# Altium schematic sheet In-Out.SchDoc
size A4
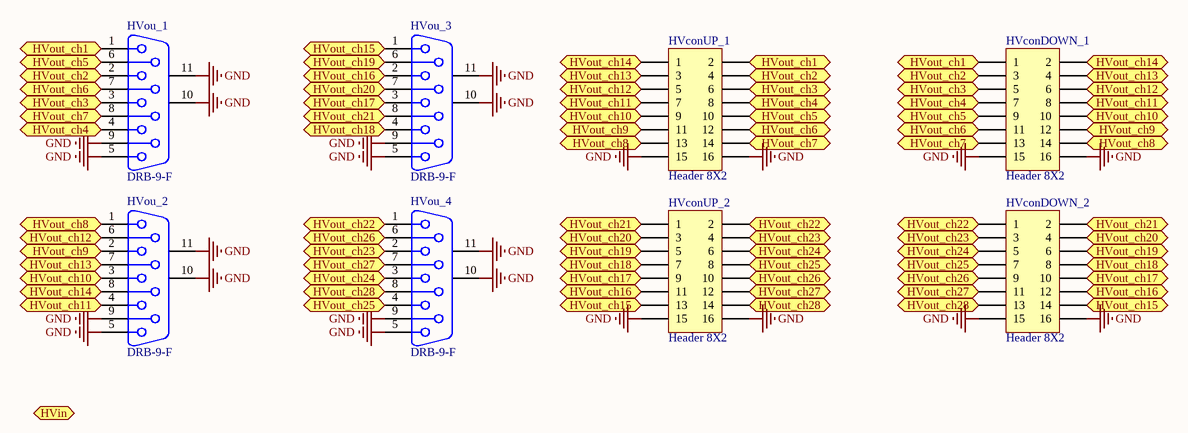
[diagram p0: In-Out.SchDoc]

## Parts
HVconDOWN_1  Header 8X2  [HDR2X8]
HVconDOWN_2  Header 8X2  [HDR2X8]
HVconUP_1  Header 8X2  [HDR2X8]
HVconUP_2  Header 8X2  [HDR2X8]
HVou_1  DRB-9-F  [DSUB1.385-2H9]
HVou_2  DRB-9-F  [DSUB1.385-2H9]
HVou_3  DRB-9-F  [DSUB1.385-2H9]
HVou_4  DRB-9-F  [DSUB1.385-2H9]

## Ports
HVin (out), HVout_ch1 (out), HVout_ch2 (out), HVout_ch3 (out), HVout_ch4 (out), HVout_ch5 (out), HVout_ch6 (out), HVout_ch7 (out), HVout_ch8 (out), HVout_ch9 (out), HVout_ch10 (out), HVout_ch11 (out), HVout_ch12 (out), HVout_ch13 (out), HVout_ch14 (out), HVout_ch15 (out), HVout_ch16 (out), HVout_ch17 (out), HVout_ch18 (out), HVout_ch19 (out), HVout_ch20 (out), HVout_ch21 (out), HVout_ch22 (out), HVout_ch23 (out), HVout_ch24 (out), HVout_ch25 (out), HVout_ch26 (out), HVout_ch27 (out), HVout_ch28 (out)

## Nets
GND: HVconDOWN_1.15 HVconDOWN_1.16 HVconDOWN_2.15 HVconDOWN_2.16 HVconUP_1.15 HVconUP_1.16 HVconUP_2.15 HVconUP_2.16 HVou_1.5 HVou_1.9 HVou_1.10(MH1) HVou_1.11(MH2) HVou_2.5 HVou_2.9 HVou_2.10(MH1) HVou_2.11(MH2) HVou_3.5 HVou_3.9 HVou_3.10(MH1) HVou_3.11(MH2) HVou_4.5 HVou_4.9 HVou_4.10(MH1) HVou_4.11(MH2)
HVout_ch1: HVconDOWN_1.1 HVconUP_1.2 HVou_1.1 ; port HVout_ch1
HVout_ch2: HVconDOWN_1.3 HVconUP_1.4 HVou_1.2 ; port HVout_ch2
HVout_ch3: HVconDOWN_1.5 HVconUP_1.6 HVou_1.3 ; port HVout_ch3
HVout_ch4: HVconDOWN_1.7 HVconUP_1.8 HVou_1.4 ; port HVout_ch4
HVout_ch5: HVconDOWN_1.9 HVconUP_1.10 HVou_1.6 ; port HVout_ch5
HVout_ch6: HVconDOWN_1.11 HVconUP_1.12 HVou_1.7 ; port HVout_ch6
HVout_ch7: HVconDOWN_1.13 HVconUP_1.14 HVou_1.8 ; port HVout_ch7
HVout_ch8: HVconDOWN_1.14 HVconUP_1.13 HVou_2.1 ; port HVout_ch8
HVout_ch9: HVconDOWN_1.12 HVconUP_1.11 HVou_2.2 ; port HVout_ch9
HVout_ch10: HVconDOWN_1.10 HVconUP_1.9 HVou_2.3 ; port HVout_ch10
HVout_ch11: HVconDOWN_1.8 HVconUP_1.7 HVou_2.4 ; port HVout_ch11
HVout_ch12: HVconDOWN_1.6 HVconUP_1.5 HVou_2.6 ; port HVout_ch12
HVout_ch13: HVconDOWN_1.4 HVconUP_1.3 HVou_2.7 ; port HVout_ch13
HVout_ch14: HVconDOWN_1.2 HVconUP_1.1 HVou_2.8 ; port HVout_ch14
HVout_ch15: HVconDOWN_2.14 HVconUP_2.13 HVou_3.1 ; port HVout_ch15
HVout_ch16: HVconDOWN_2.12 HVconUP_2.11 HVou_3.2 ; port HVout_ch16
HVout_ch17: HVconDOWN_2.10 HVconUP_2.9 HVou_3.3 ; port HVout_ch17
HVout_ch18: HVconDOWN_2.8 HVconUP_2.7 HVou_3.4 ; port HVout_ch18
HVout_ch19: HVconDOWN_2.6 HVconUP_2.5 HVou_3.6 ; port HVout_ch19
HVout_ch20: HVconDOWN_2.4 HVconUP_2.3 HVou_3.7 ; port HVout_ch20
HVout_ch21: HVconDOWN_2.2 HVconUP_2.1 HVou_3.8 ; port HVout_ch21
HVout_ch22: HVconDOWN_2.1 HVconUP_2.2 HVou_4.1 ; port HVout_ch22
HVout_ch23: HVconDOWN_2.3 HVconUP_2.4 HVou_4.2 ; port HVout_ch23
HVout_ch24: HVconDOWN_2.5 HVconUP_2.6 HVou_4.3 ; port HVout_ch24
HVout_ch25: HVconDOWN_2.7 HVconUP_2.8 HVou_4.4 ; port HVout_ch25
HVout_ch26: HVconDOWN_2.9 HVconUP_2.10 HVou_4.6 ; port HVout_ch26
HVout_ch27: HVconDOWN_2.11 HVconUP_2.12 HVou_4.7 ; port HVout_ch27
HVout_ch28: HVconDOWN_2.13 HVconUP_2.14 HVou_4.8 ; port HVout_ch28

## Library data of the parts
HVconDOWN_1 HVconDOWN_2 HVconUP_1 HVconUP_2 = Header 8X2: Header, 8-Pin, Dual row; LatestRevisionDate: 17-Jul-2002; LatestRevisionNote: Re-released for DXP Platform.; Publisher: Altium Limited
HVou_1-HVou_4 = D Connector 9: Receptacle Assembly, 9 Position, Right Angle; PackageDocument: O; Positions: 9; Published: 15-Jun-2001; LatestRevisionDate: 17-Jul-2002; LatestRevisionNote: Re-released for DXP Platform.; DatasheetDocument: 1-Sep-1999; PackageReference: 788750; Publisher: Altium Limited; Orientation: Right Angle; Gender: Receptacle